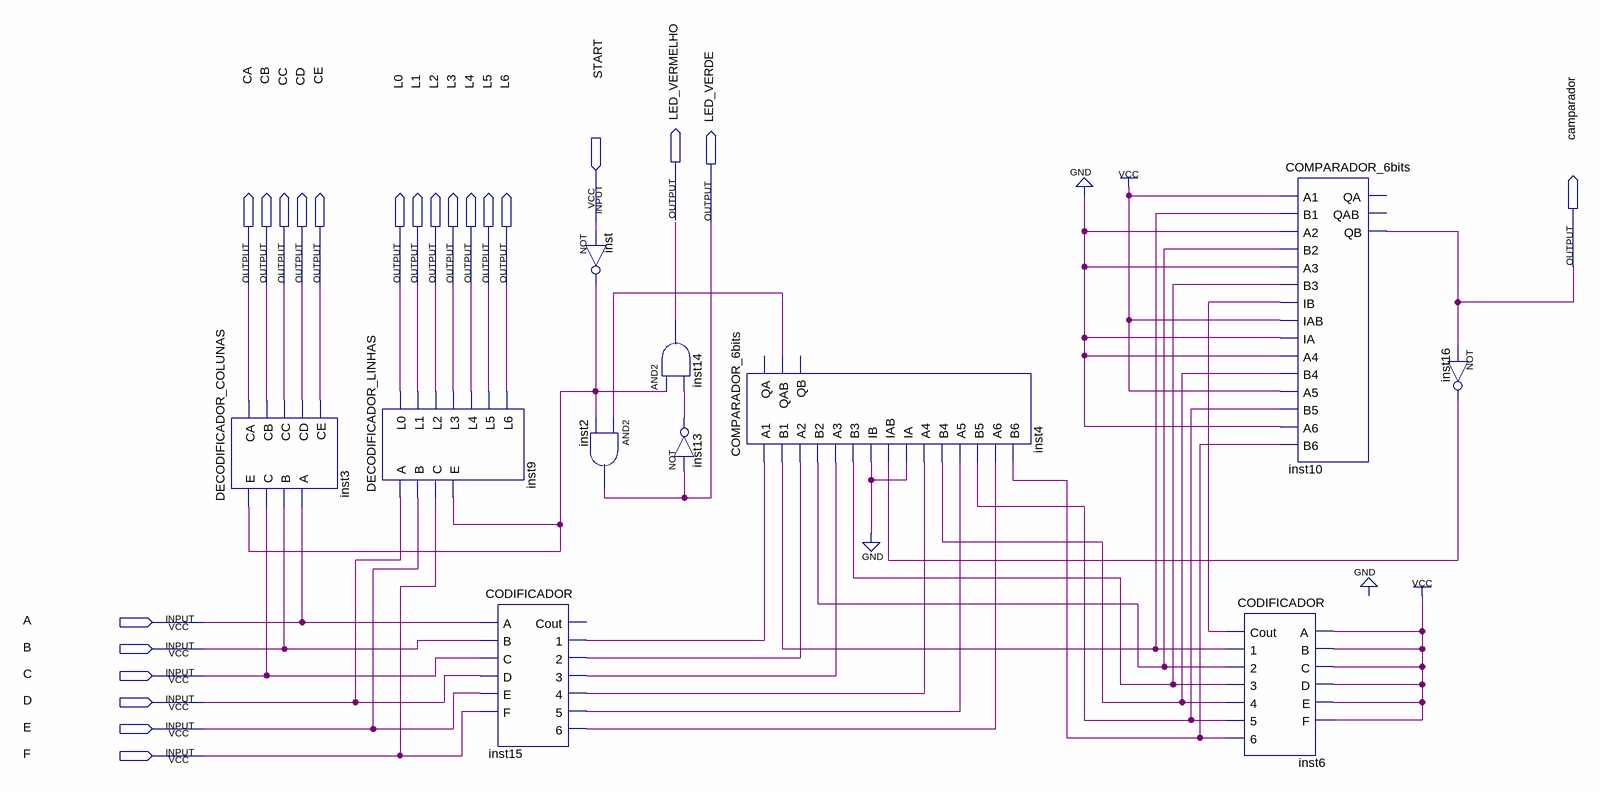
[diagram p0: schematic sheet]
// Quartus schematic continuar.bdf as structural Verilog: 11 symbols, 22 pins
module continuar (
  input  START,
  input  A,
  input  B,
  input  C,
  input  D,
  input  E,
  input  F,
  output LED_VERMELHO,
  output LED_VERDE,
  output camparador,
  output CA,
  output CB,
  output CC,
  output CD,
  output CE,
  output L0,
  output L1,
  output L2,
  output L3,
  output L4,
  output L5,
  output L6
);

  wire inst4_qab, inst6_1, inst6_2, inst6_3, inst6_4, inst6_5, inst6_6, inst6_cout, inst13_out, inst15_1,
       inst15_2, inst15_3, inst15_4, inst15_5, inst15_6, inst16_out, inst_out;

  DECODIFICADOR_COLUNAS inst3 (.E(inst_out), .C(C), .B(B), .A(A), .CA(CA), .CB(CB), .CC(CC), .CD(CD), .CE(CE));
  DECODIFICADOR_LINHAS inst9 (
    .A(D), .B(E), .C(F), .E(inst_out), .L0(L0), .L1(L1), .L2(L2), .L3(L3), .L4(L4), .L5(L5), .L6(L6));
  CODIFICADOR inst15 (
    .A(A), .B(B), .C(C), .D(D), .E(E), .F(F), .\1 (inst15_1), .\2 (inst15_2), .\3 (inst15_3), .\4 (inst15_4),
    .\5 (inst15_5), .\6 (inst15_6));  // open: Cout
  not inst (inst_out, START);
  and inst2 (LED_VERDE, inst4_qab, inst_out);
  and inst14 (LED_VERMELHO, inst_out, inst13_out);
  not inst13 (inst13_out, LED_VERDE);
  COMPARADOR_6bits inst4 (
    .A1(inst15_1), .B1(inst6_1), .A2(inst15_2), .B2(inst6_2), .A3(inst15_3), .B3(inst6_3), .IB(1'b0),
    .IAB(inst16_out), .IA(1'b0), .A4(inst15_4), .B4(inst6_4), .A5(inst15_5), .B5(inst6_5), .A6(inst15_6),
    .B6(inst6_6), .QAB(inst4_qab));  // open: QA, QB
  COMPARADOR_6bits inst10 (
    .A1(1'b1), .B1(inst6_1), .A2(1'b0), .B2(inst6_2), .A3(1'b0), .B3(inst6_3), .IB(inst6_cout), .IAB(1'b1),
    .IA(1'b0), .A4(1'b0), .B4(inst6_4), .A5(1'b1), .B5(inst6_5), .A6(1'b0), .B6(inst6_6), .QB(camparador));  // open: QA, QAB
  CODIFICADOR inst6 (
    .A(1'b1), .B(1'b1), .C(1'b1), .D(1'b1), .E(1'b1), .F(1'b1), .Cout(inst6_cout), .\1 (inst6_1),
    .\2 (inst6_2), .\3 (inst6_3), .\4 (inst6_4), .\5 (inst6_5), .\6 (inst6_6));
  not inst16 (inst16_out, camparador);
endmodule
